# Altium project Learning Altium Simulation.PrjPcb
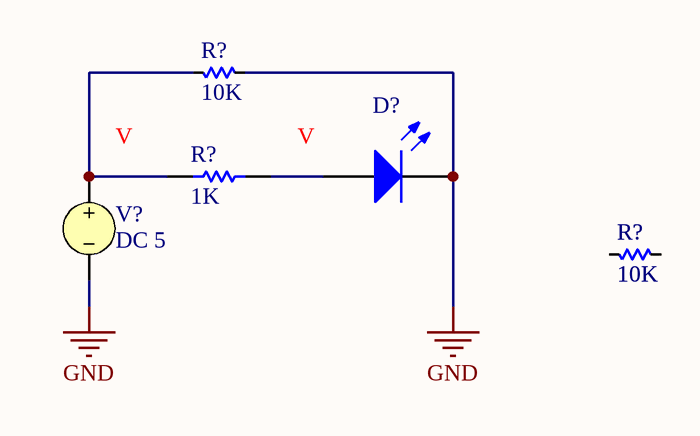
[diagram p0: main.SchDoc]
1 sheet, 6 parts. Net scope: global (net labels, ports and power ports of the same name join across sheets).

## Sheet main.SchDoc
size A4; SheetNumber: 1; SheetTotal: 1

### Parts
(Parts that share a designator on the sheet are numbered #1, #2 ... from top to bottom, then left to right.)
D?  Light-Emitting Diode  (value not drawn)
R?#1  10K  [0402]
R?#2  value 1K  (hidden comment: Resistor)
R?#3  10K  [0402]
R?#4  10K  [0402]
V?  DC 5

### Nets
GND: D?.2(K) R?#1.2 V?.2
NetD?_1: D?.1(A) R?#2.2
NetR?#1_1: R?#1.1 R?#2.1 V?.1
NetR?#3_1: R?#3.1 R?#4.1
NetR?#3_2: R?#3.2 R?#4.2

### Library data of the parts
D? = LED: AF: 1; BV: 0; BV_MAX: 1e99; EG: 1.11; FC: 0.5; IBV: 0.001; IS: 1e-14; MJSW: 0.33; NTUN: 30; TNOM: 27; XTI: 3; SimulationGenericComponent: True; CJO: 0; CJP: 0; CTA: 0; CTP: 0; FCS: 0.5; FV_MAX: 1e99; IKF: 0; IKR: 0; ISR: 1e-14; JSW: 0; JTUN: 0; JTUNSW: 0; KEG: 1; KF: 0; LEVEL: 1; N: 1; NBV: 1; NR: 1; NS: 1; PHP: 1; RS: 0; TCV: 0; TLEV: 0; TLEVC: 0; TM1: 0; TM2: 0; TPB: 0; TPHP: 0; TRS: 0; TRS2: 0; TT: 0; TTT1: 0; TTT2: 0; VJ: 1; XTITUN: 3
R?#1 R?#3 R?#4 = RT-10K0-F-1/16W-0402: RES SMD 10K OHM 1% 1/16W 0402; Alternate Manufacturer: Yageo; Alternate Manufacturer Part #: RC0402FR-0710KL; Manufacturer: Vishay Dale; Manufacturer Part #: CRCW040210K0FKED; Checked By: *; ComponentLink1description: Datasheet; ComponentLink1URL: https://www.vishay.com/docs/20035/dcrcwe3.pdf; ComponentLink2description: Manufacturer Website; Alternate Distributor Part #: 311-10.0KLRCT-ND; Created By: *; Distributor: Digikey; Distributor Part #: 541-10.0KLCT-ND; History: *; Notes: *; Part Description: RES SMD 10K OHM 1% 1/16W 0402; Population: *; ROHS: Yes; ComponentLink2URL: https://www.vishay.com/; Value: 10K
R?#2 = Resistor: TC1: 0; SimulationGenericComponent: True; TC2: 0
V? = VSRC: Voltage Source; Note: PCB Footprint - Not required; AC Magnitude: 1; AC Phase: 0; Value: 5; Published: 8-Jun-2000; LatestRevisionDate: 17-Jul-2002; LatestRevisionNote: Re-released for DXP Platform.; PackageReference: Not Applicable; Publisher: Altium Limited